# Altium schematic sheet РЕУН.468323.001_INT.SchDoc: =Name-1str
size 420 x 297 mm; SheetNumber: 11; Вид изделия: Документация; Раздел: Документация; Код документа: Э3; Вид документа: Схема электрическая принципиальная; Класс документа: Конструкторский документ; Создавать изделие в PLM: Yes; DocumentCode: РЕУН.468323.001 Э3 2D; DocumentView: Схема электрическая принципиальная; DocumentClass: Конструкторский документ; ProductView: Документация; Format: А3
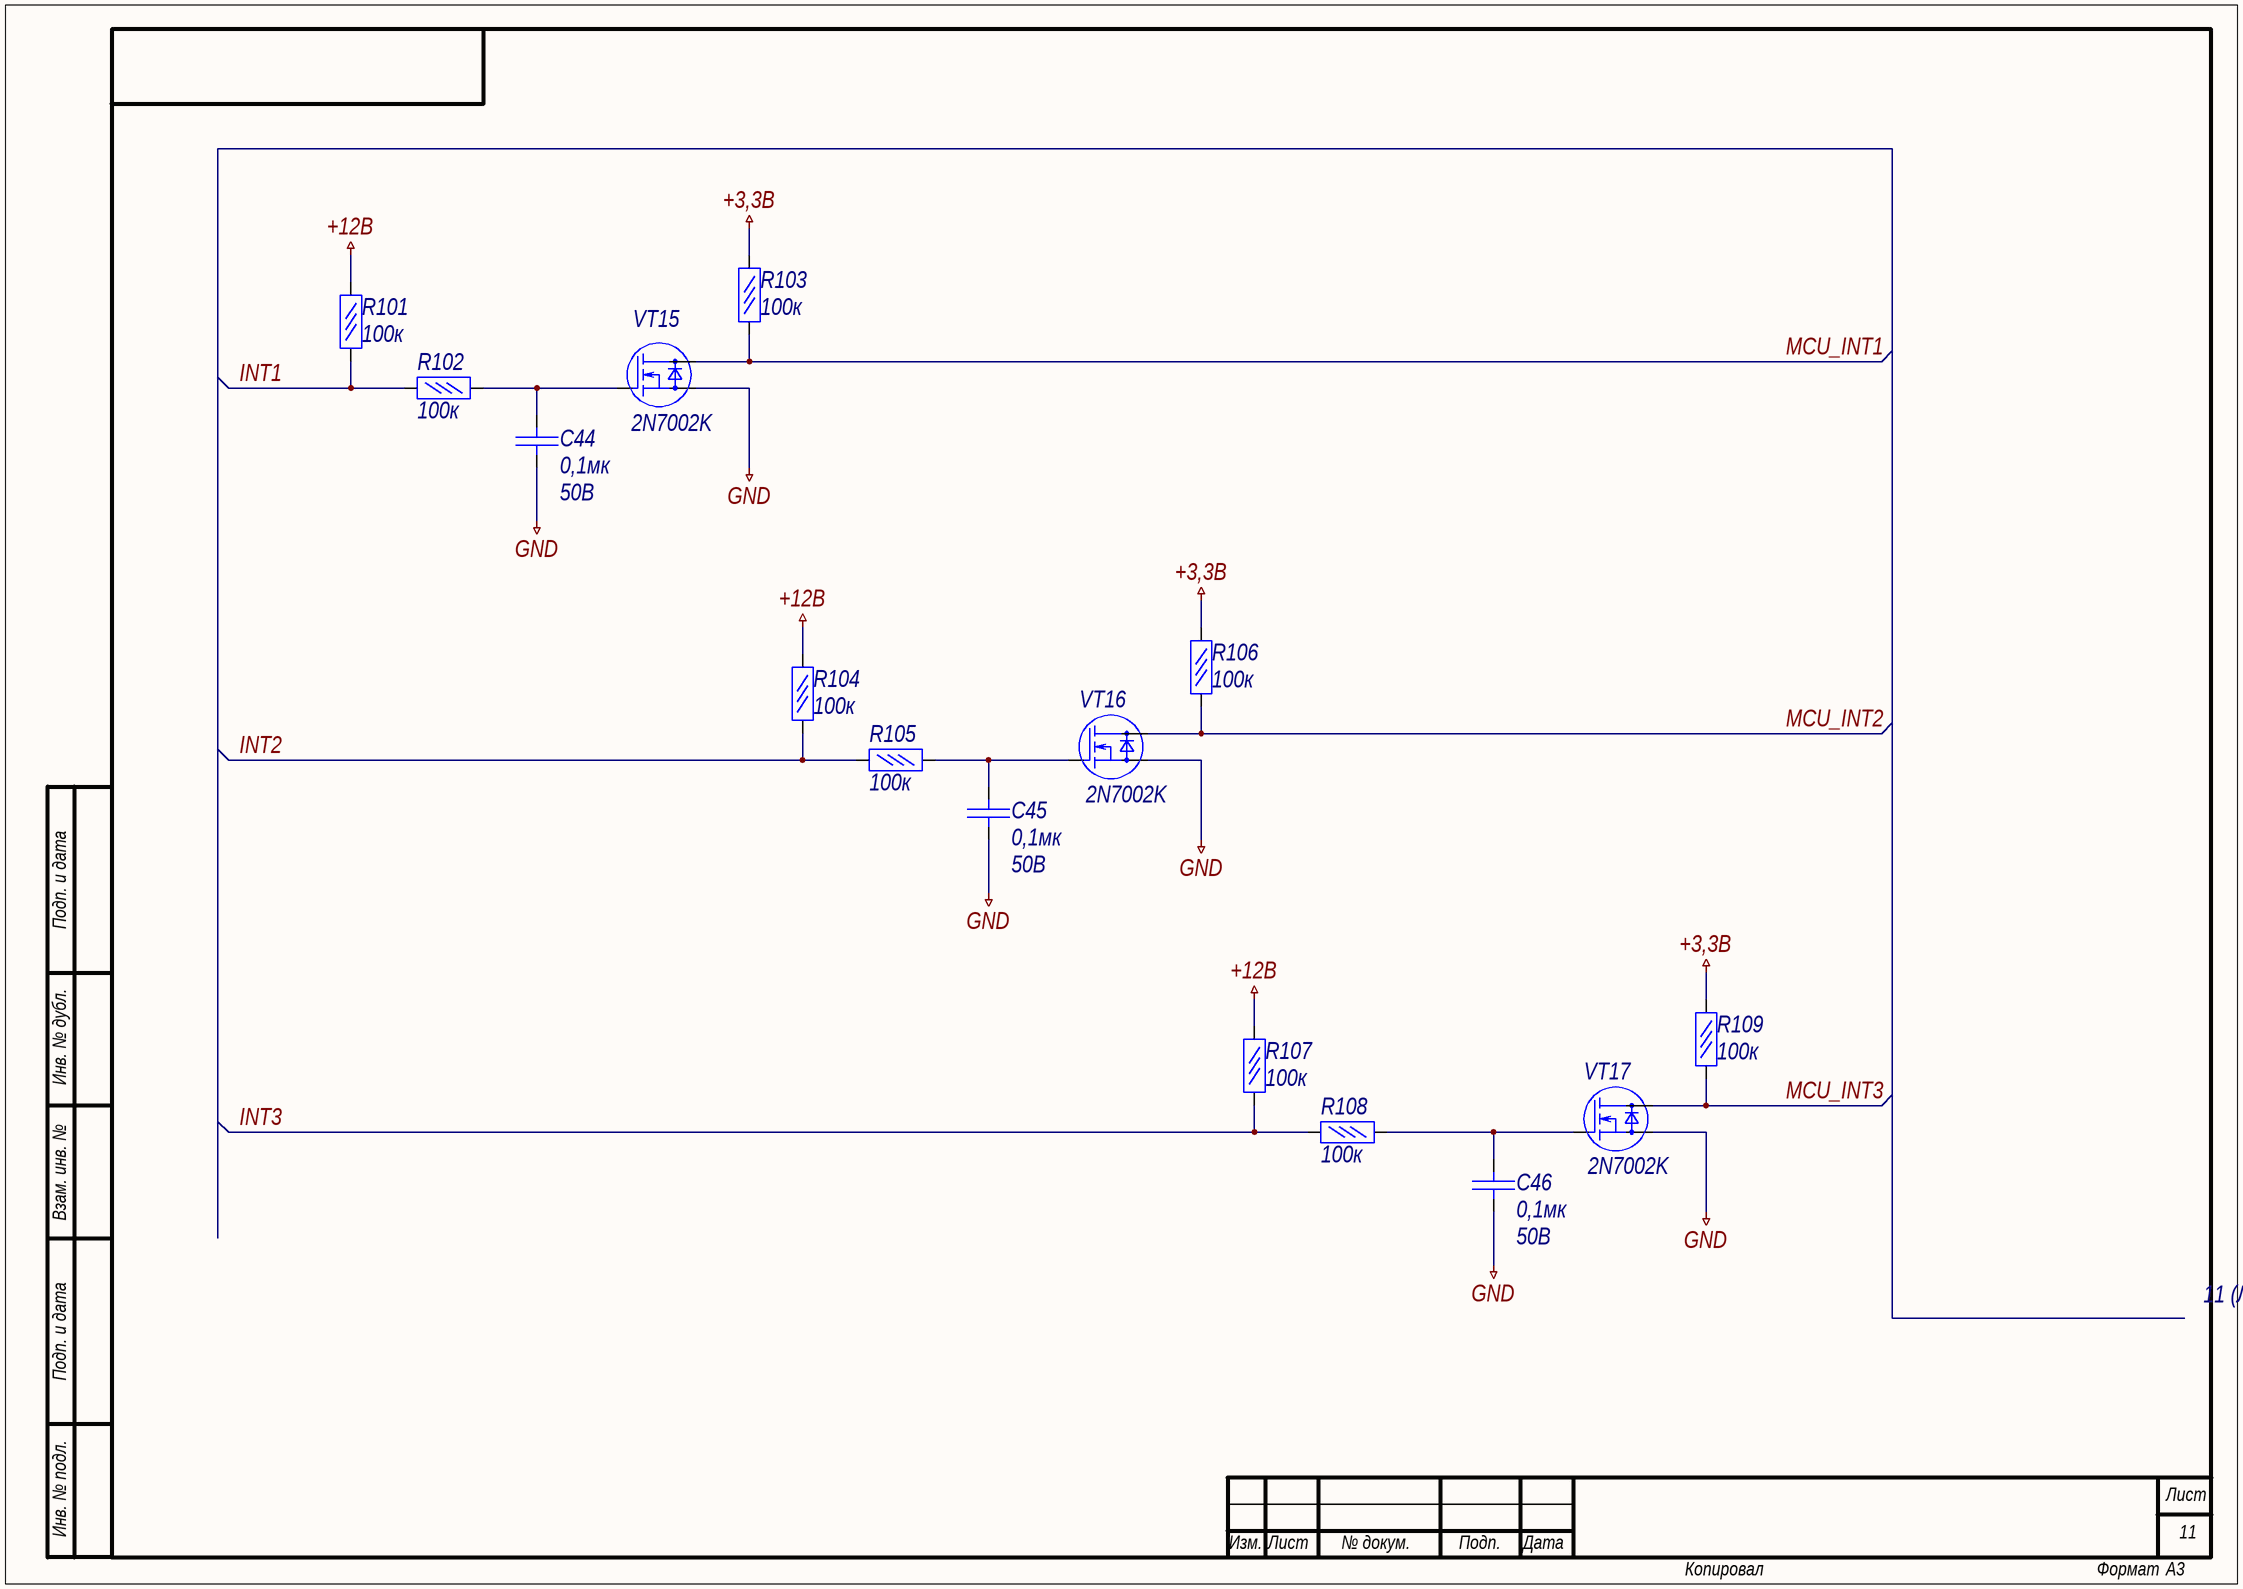
[diagram p0: РЕУН.468323.001_INT.SchDoc]

## Parts
C44  Voltage: 50В  [C0805_AA]  (hidden comment: 0,1мк)
C45  Voltage: 50В  [C0805_AA]  (hidden comment: 0,1мк)
C46  Voltage: 50В  [C0805_AA]  (hidden comment: 0,1мк)
R101  100к  [R1206]
R102  100к  [R1206]
R103  100к  [R1206]
R104  100к  [R1206]
R105  100к  [R1206]
R106  100к  [R1206]
R107  100к  [R1206]
R108  100к  [R1206]
R109  100к  [R1206]
VT15  2N7002K  [SOT23-3]
VT16  2N7002K  [SOT23-3]
VT17  2N7002K  [SOT23-3]

## Nets
+3,3В: R103.2 R106.2 R109.2
+12В: R101.2 R104.2 R107.2
GND: C44.1 C45.1 C46.1 VT15.2(S) VT16.2(S) VT17.2(S)
INT1: R101.1 R102.1
INT2: R104.1 R105.1
INT3: R107.1 R108.1
MCU_INT1: R103.1 VT15.3(D)
MCU_INT2: R106.1 VT16.3(D)
MCU_INT3: R109.1 VT17.3(D)
NetC44_2: C44.2 R102.2 VT15.1(G)
NetC45_2: C45.2 R105.2 VT16.1(G)
NetC46_2: C46.2 R108.2 VT17.1(G)

## Notes on the sheet
- 11 (Лист 1, 3, 4, 5, 6, 7, 8, 9, 10, 12)
- Подп. и дата
- Инв. № дубл.
- Взам. инв. №
- Инв. № подл.
- Лист
- Изм.
- № докум.
- Подп.
- Дата
- Копировал
- Формат

## Library data of the parts
C44-C46 = Конденсатор кер.: Value: 0,1мк
R101-R109 = Резистор  0,05Вт: Резистор 0,05Вт; Power rating: 0,05Вт; Value: 100к
VT15-VT17 = mosfet-n: Name: 2N7002K